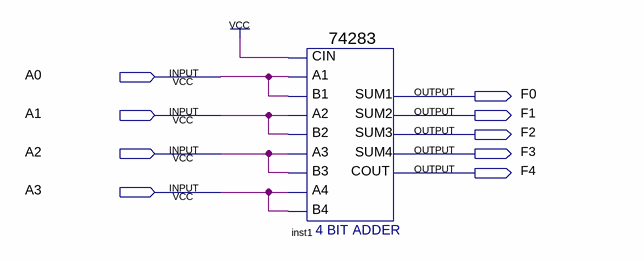
[diagram p0: schematic sheet]
// Quartus schematic Somador.bdf as structural Verilog: 1 symbols, 9 pins
module Somador (
  input  A0,
  input  A1,
  input  A2,
  input  A3,
  output F0,
  output F1,
  output F2,
  output F3,
  output F4
);

  \74283  inst1 (
    .CIN(1'b1), .A1(A0), .A2(A1), .B2(A1), .A3(A2), .A4(A3), .B4(A3), .B1(A0), .B3(A2), .SUM4(F3), .COUT(F4),
    .SUM1(F0), .SUM2(F1), .SUM3(F2));
endmodule
